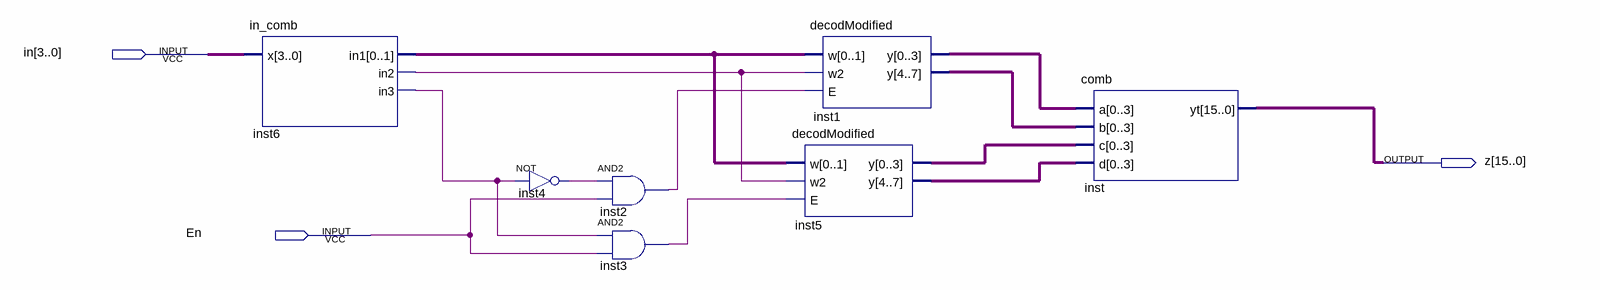
[diagram p0: schematic sheet]
// Quartus schematic 4to16.bdf as structural Verilog: 7 symbols, 3 pins
module \4to16  (
  input  [3:0] in,
  input  En,
  output [15:0] z
);

  wire inst2_out, inst3_out, inst4_out, inst6_in2, inst6_in3;
  wire [1:0] inst6_in1;
  wire [3:0] inst1_y, inst1_y_2, inst5_y, inst5_y_2;

  in_comb inst6 (.x(in), .in1(inst6_in1), .in2(inst6_in2), .in3(inst6_in3));
  not inst4 (inst4_out, inst6_in3);
  and inst2 (inst2_out, inst4_out, En);
  and inst3 (inst3_out, inst6_in3, En);
  decodModified inst1 (
    .w(inst6_in1), .w2(inst6_in2), .E(inst2_out),
    .y({inst1_y_2[0], inst1_y_2[1], inst1_y_2[2], inst1_y_2[3], inst1_y[0], inst1_y[1], inst1_y[2], inst1_y[3]}));
  decodModified inst5 (
    .w(inst6_in1), .w2(inst6_in2), .E(inst3_out),
    .y({inst5_y_2[0], inst5_y_2[1], inst5_y_2[2], inst5_y_2[3], inst5_y[0], inst5_y[1], inst5_y[2], inst5_y[3]}));
  comb inst (.a(inst1_y), .b(inst1_y_2), .c(inst5_y), .d(inst5_y_2), .yt(z));
endmodule
